# EAGLE design R-Split_Level_Shifter_1k_2k (EAGLE 7.2.0)
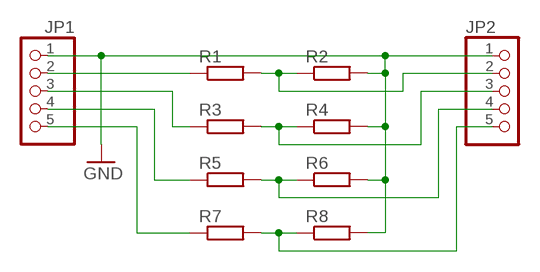
[diagram p0: schematic, sheet 1]

## Parts
JP1  PINHD-1X5  [1X05]
JP2  PINHD-1X5  [1X05]
R1  R-EU_0207/7  [0207/7]
R2  R-EU_0207/7  [0207/7]
R3  R-EU_0207/7  [0207/7]
R4  R-EU_0207/7  [0207/7]
R5  R-EU_0207/7  [0207/7]
R6  R-EU_0207/7  [0207/7]
R7  R-EU_0207/7  [0207/7]
R8  R-EU_0207/7  [0207/7]

## Nets
GND: JP1.1 JP2.1 R2.2 R4.2 R6.2 R8.2
N$1: JP1.2 R1.1
N$2: JP2.2 R1.2 R2.1
N$3: JP1.3 R3.1
N$4: JP2.3 R3.2 R4.1
N$5: JP1.4 R5.1
N$6: JP1.5 R7.1
N$7: JP2.4 R5.2 R6.1
N$8: JP2.5 R7.2 R8.1

## Library data of the parts
JP1 JP2 = pinhead:PINHD-1X5: PIN HEADER
R1-R8 = rcl:R-EU_: RESISTOR, European symbol

## Board
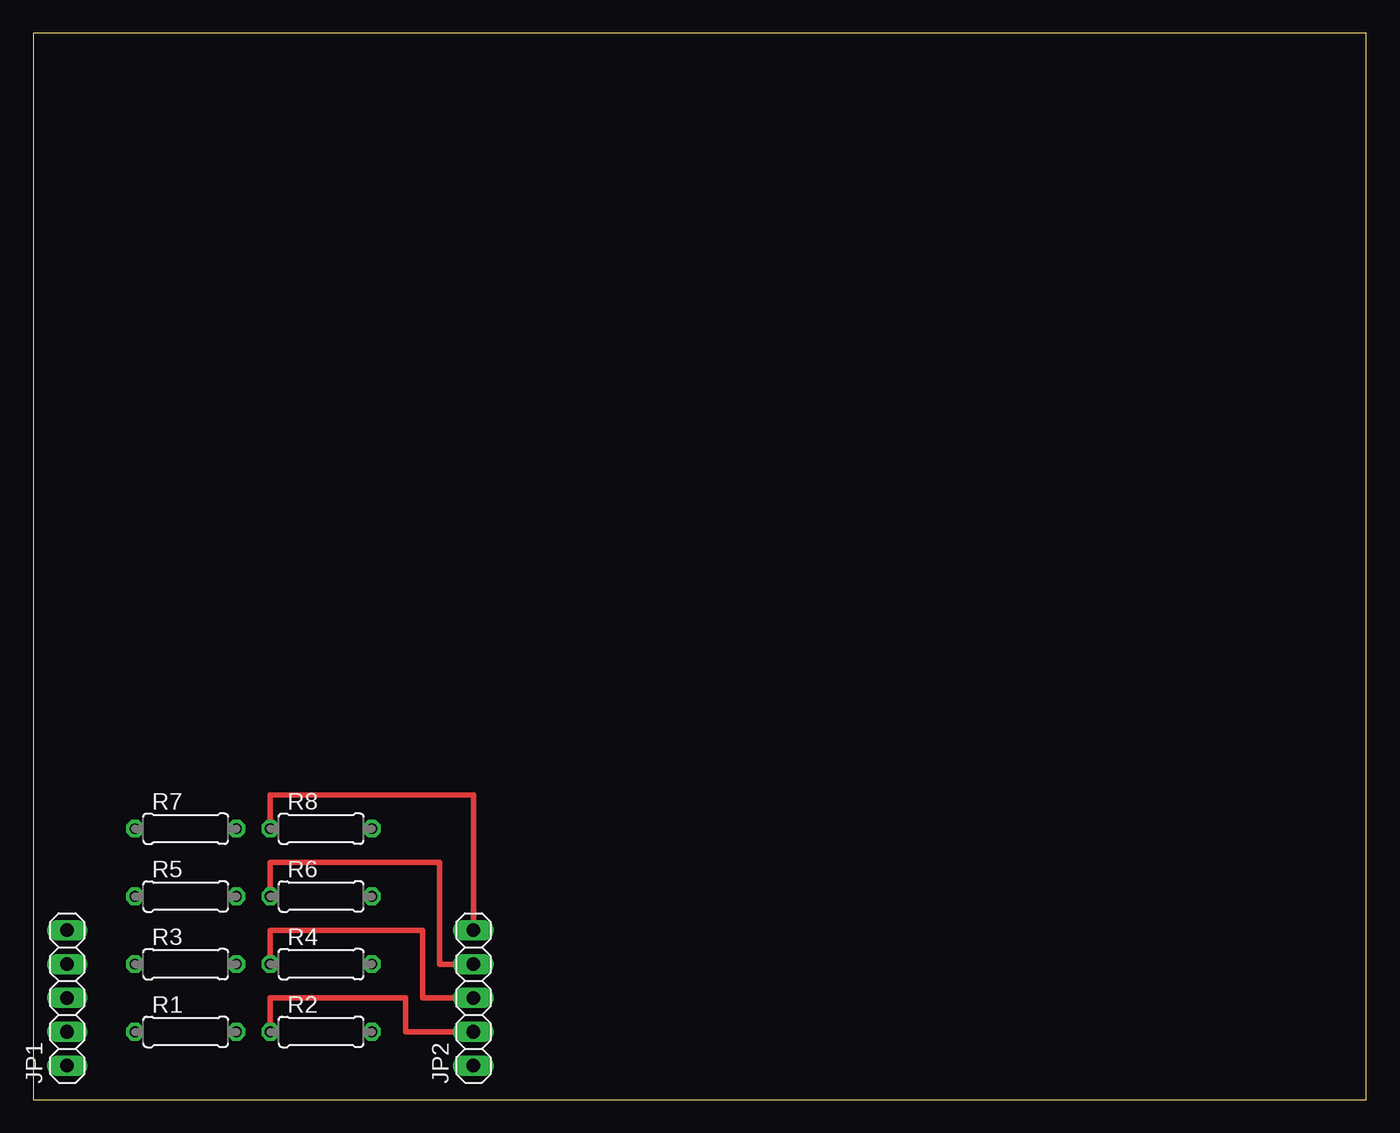
[diagram p1: board, top side]
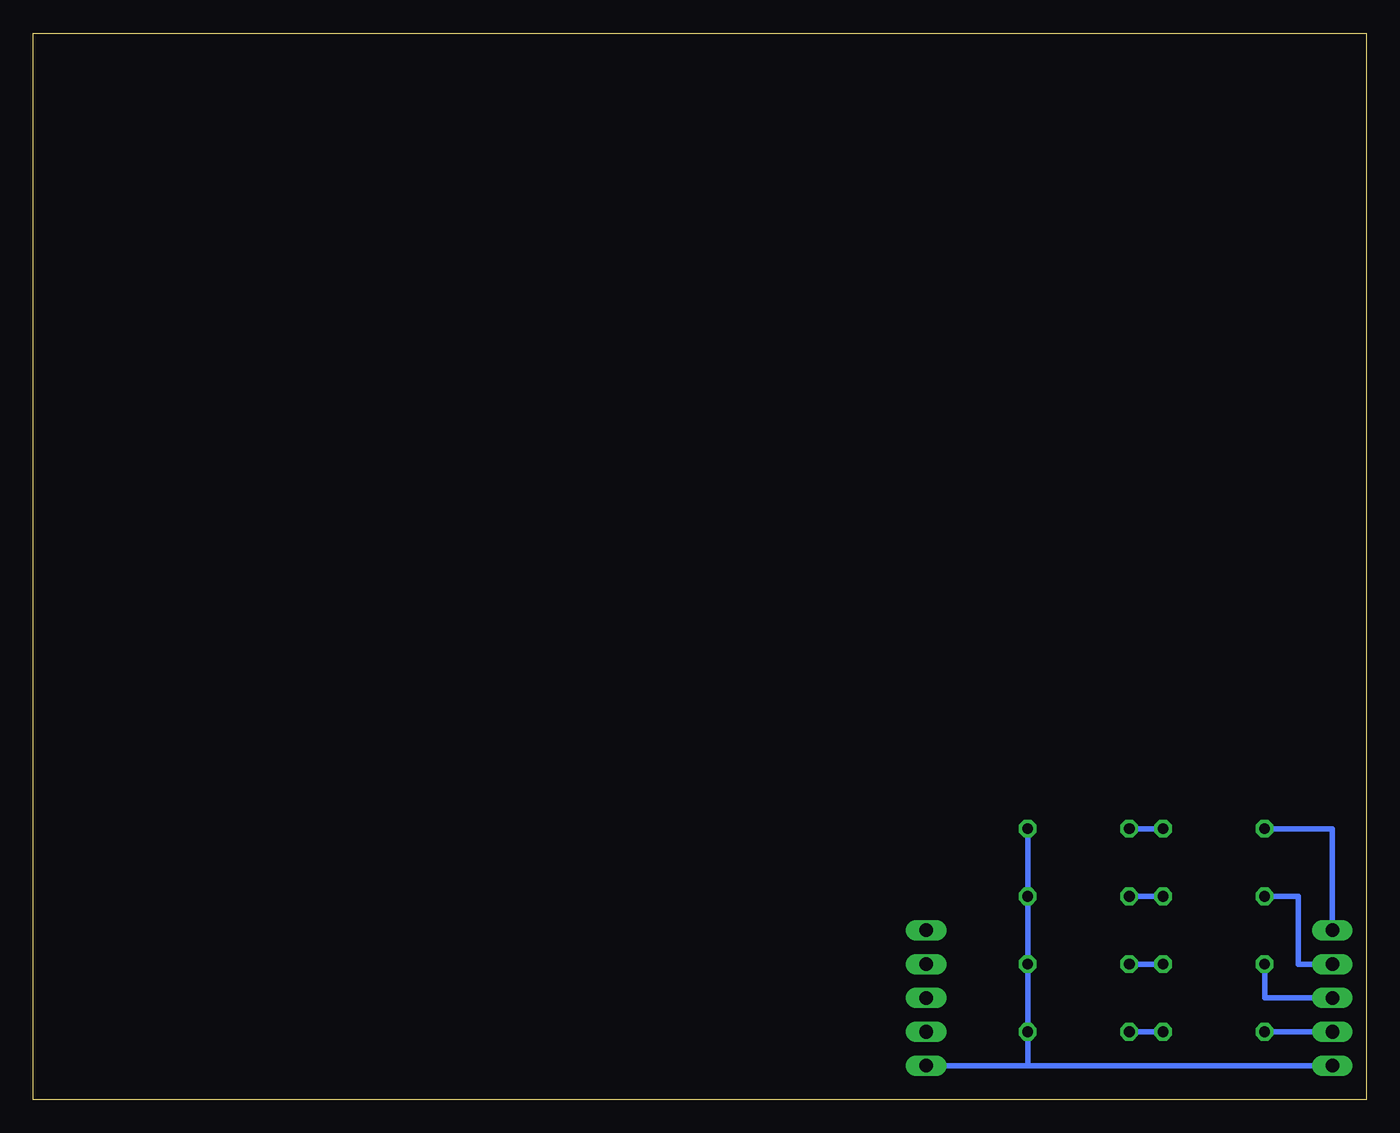
[diagram p2: board, bottom side, seen from below]

Size 100 x 80 mm. Coordinates in mm from the lower left corner, seen from the top.
Outline: 0,0 100,0 100,80 0,80 0,0
Copper layers (1*16): Top 0.035mm / dielectric 1.5mm / Bottom 0.035mm
Design rules "default": minimum track width 10mil, minimum drill 24mil, track to track 8mil, track to pad 8mil, pad to pad 8mil, via to via 8mil, smd to smd 8mil, copper to edge 40mil, drill to drill 8mil, minimum pad ring 10mil, minimum via ring 8mil, stop-mask expansion 4mil, vias tented up to drill 0mil, thermal gap 10mil

### Footprints (pad centres in the part's own frame; a part is rotated, then mirrored left to right if it is on the bottom)
1X05 = drill 1.016 long: 1 -5.08,0; 2 -2.54,0; 3 0,0; 4 2.54,0; 5 5.08,0
0207/7 = drill 0.813 octagon: 1 -3.81,0; 2 3.81,0

### Placement (x,y rotation side)
JP1  2.54,7.62 90 top
JP2  33.02,7.62 90 top
R1  11.43,5.08 0 top
R2  21.59,5.08 0 top
R3  11.43,10.16 0 top
R4  21.59,10.16 0 top
R5  11.43,15.24 0 top
R6  21.59,15.24 0 top
R7  11.43,20.32 0 top
R8  21.59,20.32 0 top

### Tracks (layer width: path | path; a pad name or v marks a point on that pad's centre or on a via)
GND
  Bottom 0.406: JP1.1 25.4,2.54 | 25.4,2.54 JP2.1 | 25.4,2.54 R2.2 R4.2 R6.2 R8.2
N$1
  Bottom 0.406: R1.1 JP1.2
N$2
  Top 0.406: R2.1 17.78,7.62 27.94,7.62 27.94,5.08 JP2.2
  Bottom 0.406: R1.2 R2.1
N$3
  Bottom 0.406: R3.1 7.62,7.62 JP1.3
N$4
  Top 0.406: R4.1 17.78,12.7 29.21,12.7 29.21,7.62 JP2.3
  Bottom 0.406: R3.2 R4.1
N$5
  Bottom 0.406: R5.1 5.08,15.24 5.08,10.16 JP1.4
N$6
  Bottom 0.406: JP1.5 2.54,20.32 R7.1
N$7
  Top 0.406: R6.1 17.78,17.78 30.48,17.78 30.48,10.16 JP2.4
  Bottom 0.406: R5.2 R6.1
N$8
  Top 0.406: R8.1 17.78,22.86 33.02,22.86 JP2.5
  Bottom 0.406: R7.2 R8.1